# Altium schematic sheet rev02_17.SchDoc
size 282 x 200 mm
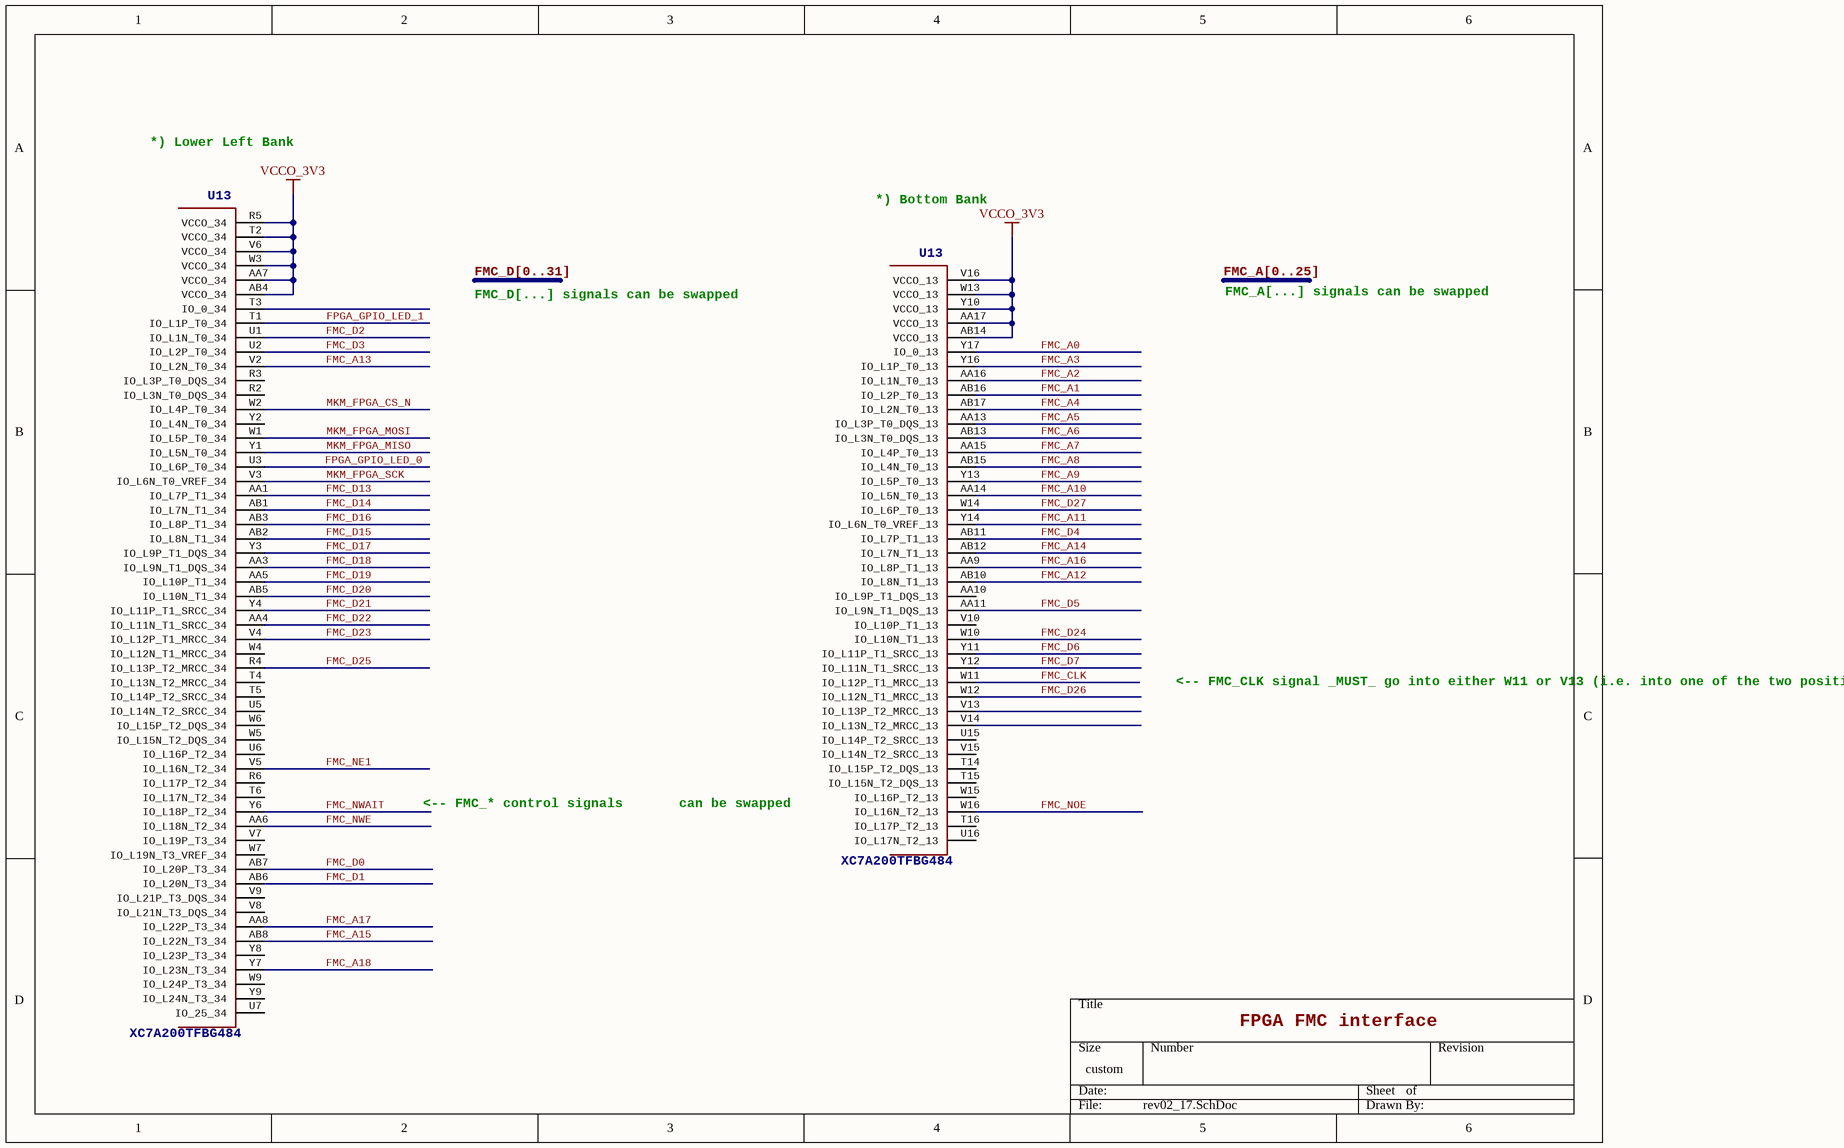
[diagram p0: rev02_17.SchDoc]

## Parts
U13  >NAME: U13  [BGA484C100P22X22_2300X2300X254]  (hidden comment: XC7A200TFBG484)  (parts B,F of 17)

## Nets
VCCO_3V3: U13.AA7(VCCO_34) U13.AA17(VCCO_13) U13.AB4(VCCO_34) U13.AB14(VCCO_13) U13.R5(VCCO_34) U13.T2(VCCO_34) U13.V6(VCCO_34) U13.V16(VCCO_13) U13.W3(VCCO_34) U13.W13(VCCO_13) U13.Y10(VCCO_13)
FMC_A0: U13.Y17(IO_0_13)
FMC_A1: U13.AB16(IO_L2P_T0_13)
FMC_A2: U13.AA16(IO_L1N_T0_13)
FMC_A3: U13.Y16(IO_L1P_T0_13)
FMC_A4: U13.AB17(IO_L2N_T0_13)
FMC_A5: U13.AA13(IO_L3P_T0_DQS_13)
FMC_A6: U13.AB13(IO_L3N_T0_DQS_13)
FMC_A7: U13.AA15(IO_L4P_T0_13)
FMC_A8: U13.AB15(IO_L4N_T0_13)
FMC_A9: U13.Y13(IO_L5P_T0_13)
FMC_A10: U13.AA14(IO_L5N_T0_13)
FMC_A11: U13.Y14(IO_L6N_T0_VREF_13)
FMC_A12: U13.AB10(IO_L8N_T1_13)
FMC_A13: U13.V2(IO_L2N_T0_34)
FMC_A14: U13.AB12(IO_L7N_T1_13)
FMC_A15: U13.AB8(IO_L22N_T3_34)
FMC_A16: U13.AA9(IO_L8P_T1_13)
FMC_A17: U13.AA8(IO_L22P_T3_34)
FMC_A18: U13.Y7(IO_L23N_T3_34)
FMC_CLK: U13.W11(IO_L12P_T1_MRCC_13)
FMC_D0: U13.AB7(IO_L20P_T3_34)
FMC_D1: U13.AB6(IO_L20N_T3_34)
FMC_D2: U13.U1(IO_L1N_T0_34)
FMC_D3: U13.U2(IO_L2P_T0_34)
FMC_D4: U13.AB11(IO_L7P_T1_13)
FMC_D5: U13.AA11(IO_L9N_T1_DQS_13)
FMC_D6: U13.Y11(IO_L11P_T1_SRCC_13)
FMC_D7: U13.Y12(IO_L11N_T1_SRCC_13)
FMC_D13: U13.AA1(IO_L7P_T1_34)
FMC_D14: U13.AB1(IO_L7N_T1_34)
FMC_D15: U13.AB2(IO_L8N_T1_34)
FMC_D16: U13.AB3(IO_L8P_T1_34)
FMC_D17: U13.Y3(IO_L9P_T1_DQS_34)
FMC_D18: U13.AA3(IO_L9N_T1_DQS_34)
FMC_D19: U13.AA5(IO_L10P_T1_34)
FMC_D20: U13.AB5(IO_L10N_T1_34)
FMC_D21: U13.Y4(IO_L11P_T1_SRCC_34)
FMC_D22: U13.AA4(IO_L11N_T1_SRCC_34)
FMC_D23: U13.V4(IO_L12P_T1_MRCC_34)
FMC_D24: U13.W10(IO_L10N_T1_13)
FMC_D25: U13.R4(IO_L13P_T2_MRCC_34)
FMC_D26: U13.W12(IO_L12N_T1_MRCC_13)
FMC_D27: U13.W14(IO_L6P_T0_13)
FMC_NE1: U13.V5(IO_L16N_T2_34)
FMC_NOE: U13.W16(IO_L16N_T2_13)
FMC_NWAIT: U13.Y6(IO_L18P_T2_34)
FMC_NWE: U13.AA6(IO_L18N_T2_34)
FPGA_GPIO_LED_0: U13.U3(IO_L6P_T0_34)
FPGA_GPIO_LED_1: U13.T1(IO_L1P_T0_34)
MKM_FPGA_CS_N: U13.W2(IO_L4P_T0_34)
MKM_FPGA_MISO: U13.Y1(IO_L5N_T0_34)
MKM_FPGA_MOSI: U13.W1(IO_L5P_T0_34)
MKM_FPGA_SCK: U13.V3(IO_L6N_T0_VREF_34)

Not connected (* = marked no-connect by the designer): U13 AA10(IO_L9P_T1_DQS_13) R2(IO_L3N_T0_DQS_34) R3(IO_L3P_T0_DQS_34) R6(IO_L17P_T2_34) T3(IO_0_34) T4(IO_L13N_T2_MRCC_34) T5(IO_L14P_T2_SRCC_34) T6(IO_L17N_T2_34) T14(IO_L15P_T2_DQS_13) T15(IO_L15N_T2_DQS_13) T16(IO_L17P_T2_13) U5(IO_L14N_T2_SRCC_34) U6(IO_L16P_T2_34) U7(IO_25_34) U15(IO_L14P_T2_SRCC_13) U16(IO_L17N_T2_13) V7(IO_L19P_T3_34) V8(IO_L21N_T3_DQS_34) V9(IO_L21P_T3_DQS_34) V10(IO_L10P_T1_13) V13(IO_L13P_T2_MRCC_13) V14(IO_L13N_T2_MRCC_13) V15(IO_L14N_T2_SRCC_13) W4(IO_L12N_T1_MRCC_34) W5(IO_L15N_T2_DQS_34) W6(IO_L15P_T2_DQS_34) W7(IO_L19N_T3_VREF_34) W9(IO_L24P_T3_34) W15(IO_L16P_T2_13) Y2(IO_L4N_T0_34) Y8(IO_L23P_T3_34) Y9(IO_L24N_T3_34)

## Buses and harness runs
bus FMC_A[0..25]
bus FMC_D[0..31]

## Notes on the sheet
- *) Lower Left Bank
- *) Bottom Bank
- FMC_D[...] signals can be swapped
- FMC_A[...] signals can be swapped
- <-- FMC_CLK signal _MUST_ go
  into either W11 or V13 (i.e. into
  one of the two positive (master)
  sides of the two available
  MRCC differential pairs)
- <-- FMC_* control signals
  can be swapped
- FPGA FMC interface

## Library data of the parts
U13 = XC7A200TFBG484: Xilinx FPGA: XC7A200TFBG484; MPN: XC7A200T-1FBG484C; MFR: Xilinx; OC_DIGIKEY: 122-1871-ND; >VALUE: XC7A200TFBG484